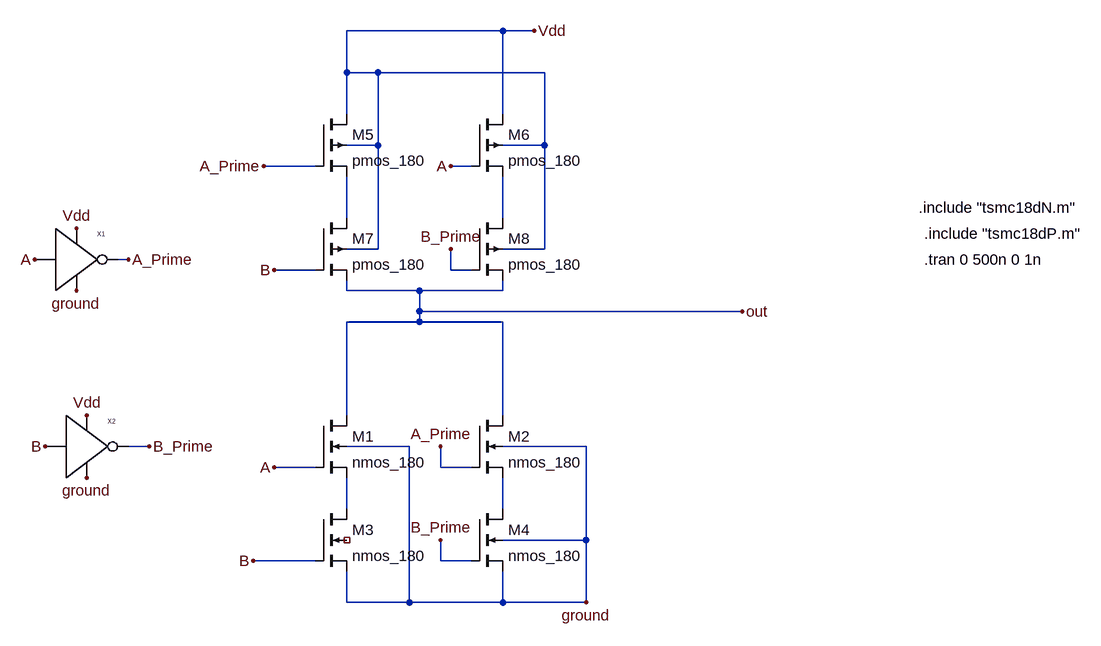
[diagram p0: schematic CMOS_XOR.asc]
CMOS_XOR.asc, the LTspice schematic file:
Version 4.1
SHEET 1 956 13728
WIRE -11952 12752 -12192 12752
WIRE -11904 12752 -11952 12752
WIRE -12192 12816 -12192 12752
WIRE -12144 12816 -12192 12816
WIRE -11888 12816 -12144 12816
WIRE -12192 12880 -12192 12816
WIRE -11952 12880 -11952 12752
WIRE -12144 12928 -12144 12816
WIRE -12144 12928 -12192 12928
WIRE -11888 12928 -11888 12816
WIRE -11888 12928 -11952 12928
WIRE -12240 12960 -12320 12960
WIRE -12000 12960 -12032 12960
WIRE -12192 13040 -12192 12976
WIRE -11952 13040 -11952 12976
WIRE -12144 13088 -12144 12928
WIRE -12144 13088 -12192 13088
WIRE -11888 13088 -11888 12928
WIRE -11888 13088 -11952 13088
WIRE -12528 13104 -12544 13104
WIRE -12240 13120 -12304 13120
WIRE -12032 13120 -12032 13088
WIRE -12000 13120 -12032 13120
WIRE -12192 13152 -12192 13136
WIRE -12080 13152 -12192 13152
WIRE -11952 13152 -11952 13136
WIRE -11952 13152 -12080 13152
WIRE -12080 13184 -12080 13152
WIRE -11584 13184 -12080 13184
WIRE -12080 13200 -12080 13184
WIRE -12080 13200 -12192 13200
WIRE -11952 13200 -12080 13200
WIRE -12192 13344 -12192 13200
WIRE -11952 13344 -11952 13200
WIRE -12496 13392 -12528 13392
WIRE -12096 13392 -12192 13392
WIRE -11824 13392 -11952 13392
WIRE -12240 13424 -12304 13424
WIRE -12048 13424 -12048 13392
WIRE -12000 13424 -12048 13424
WIRE -12192 13488 -12192 13440
WIRE -11952 13488 -11952 13440
WIRE -11824 13536 -11824 13392
WIRE -11824 13536 -11952 13536
WIRE -12240 13568 -12336 13568
WIRE -12048 13568 -12048 13536
WIRE -12000 13568 -12048 13568
WIRE -12192 13632 -12192 13584
WIRE -12096 13632 -12096 13392
WIRE -12096 13632 -12192 13632
WIRE -11952 13632 -11952 13584
WIRE -11952 13632 -12096 13632
WIRE -11824 13632 -11824 13536
WIRE -11824 13632 -11952 13632
FLAG -11584 13184 out
FLAG -11904 12752 Vdd
FLAG -11824 13632 ground
FLAG -12672 13104 A
FLAG -12336 13568 B
FLAG -12656 13392 B
FLAG -12608 13056 Vdd
FLAG -12592 13344 Vdd
FLAG -12608 13152 ground
FLAG -12592 13440 ground
FLAG -12032 12960 A
FLAG -12304 13424 A
FLAG -12304 13120 B
FLAG -12320 12960 A_Prime
FLAG -12048 13392 A_Prime
FLAG -12048 13536 B_Prime
FLAG -12032 13088 B_Prime
FLAG -12528 13104 A_Prime
FLAG -12496 13392 B_Prime
SYMBOL nmos4 -12240 13344 R0
SYMATTR InstName M1
SYMATTR Value nmos_180
SYMATTR Value2 l=180n w=1u
SYMBOL nmos4 -12000 13344 R0
SYMATTR InstName M2
SYMATTR Value nmos_180
SYMATTR Value2 l=180n w=1u
SYMBOL nmos4 -12240 13488 R0
SYMATTR InstName M3
SYMATTR Value nmos_180
SYMATTR Value2 l=180n w=1u
SYMBOL nmos4 -12000 13488 R0
SYMATTR InstName M4
SYMATTR Value nmos_180
SYMATTR Value2 l=180n w=1u
SYMBOL pmos4 -12240 12880 R0
SYMATTR InstName M5
SYMATTR Value pmos_180
SYMATTR Value2 l=180n w=1u
SYMBOL pmos4 -12000 12880 R0
SYMATTR InstName M6
SYMATTR Value pmos_180
SYMATTR Value2 l=180n w=1u
SYMBOL pmos4 -12240 13040 R0
SYMATTR InstName M7
SYMATTR Value pmos_180
SYMATTR Value2 l=180n w=1u
SYMBOL pmos4 -12000 13040 R0
SYMATTR InstName M8
SYMATTR Value pmos_180
SYMATTR Value2 l=180n w=1u
SYMBOL CMOS_NOT -12624 13104 R0
SYMATTR InstName X1
SYMBOL CMOS_NOT -12608 13392 R0
SYMATTR InstName X2
TEXT -11312 13024 Left 2 !.include "tsmc18dN.m"
TEXT -11304 13064 Left 2 !.include "tsmc18dP.m"
TEXT -11304 13104 Left 2 !.tran 0 500n 0 1n

The netlist it stands for:
* CMOS_XOR.asc
M1 out A N003 ground nmos_180 l=180n w=1u
M2 out A_Prime N004 ground nmos_180 l=180n w=1u
M3 N003 B ground NC_01 nmos_180 l=180n w=1u
M4 N004 B_Prime ground ground nmos_180 l=180n w=1u
M5 Vdd A_Prime N001 Vdd pmos_180 l=180n w=1u
M6 Vdd A N002 Vdd pmos_180 l=180n w=1u
M7 N001 B out Vdd pmos_180 l=180n w=1u
M8 N002 B_Prime out Vdd pmos_180 l=180n w=1u
X§X1 Vdd ground A A_Prime CMOS_NOT  ; pins Vdd ground in out
X§X2 Vdd ground B B_Prime CMOS_NOT  ; pins Vdd ground in out
.model NMOS NMOS
.model PMOS PMOS
.lib standard.mos
.include "tsmc18dN.m"
.include "tsmc18dP.m"
.tran 0 500n 0 1n
.backanno
.end